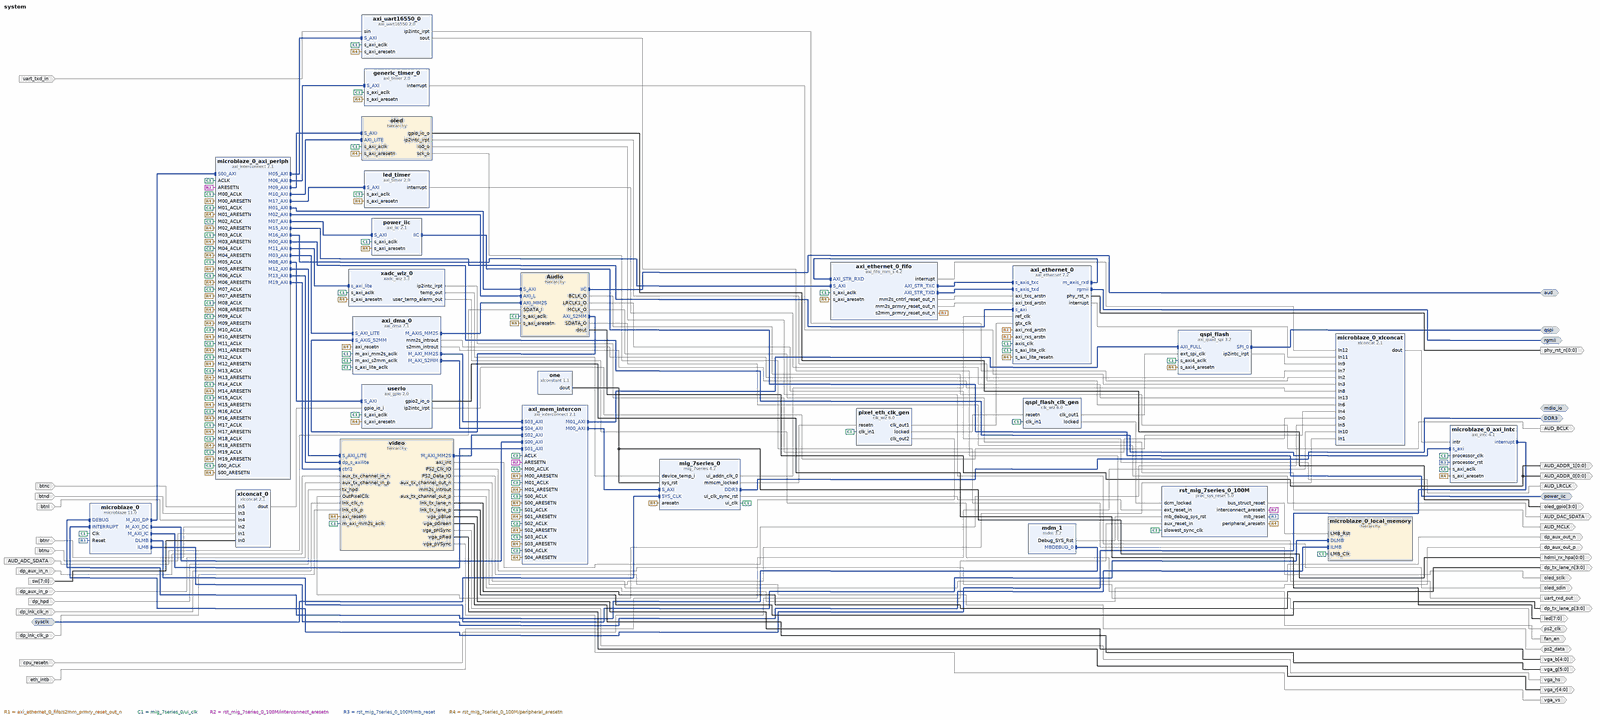
[diagram p0: block diagram of the top level, whole]
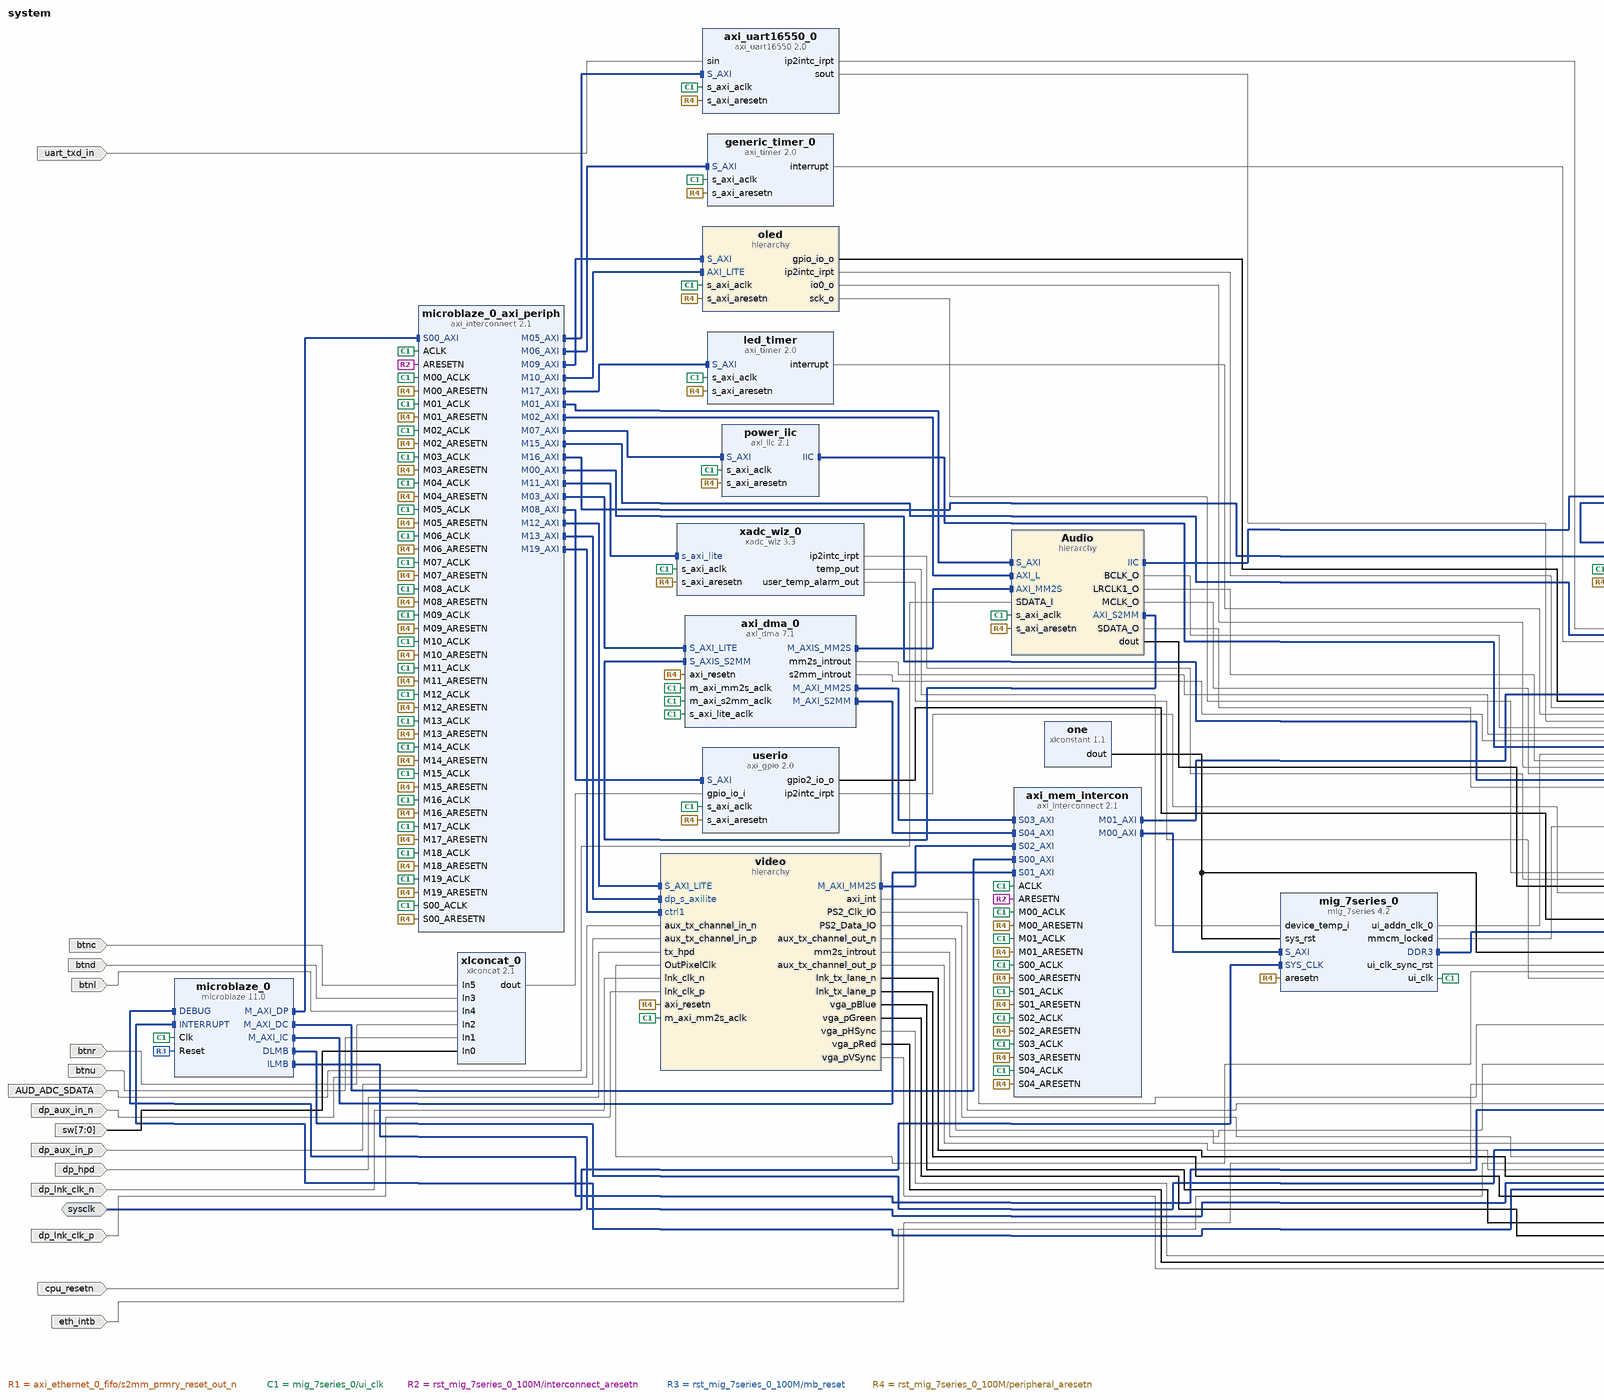
[diagram p1: block diagram of the top level, left part]
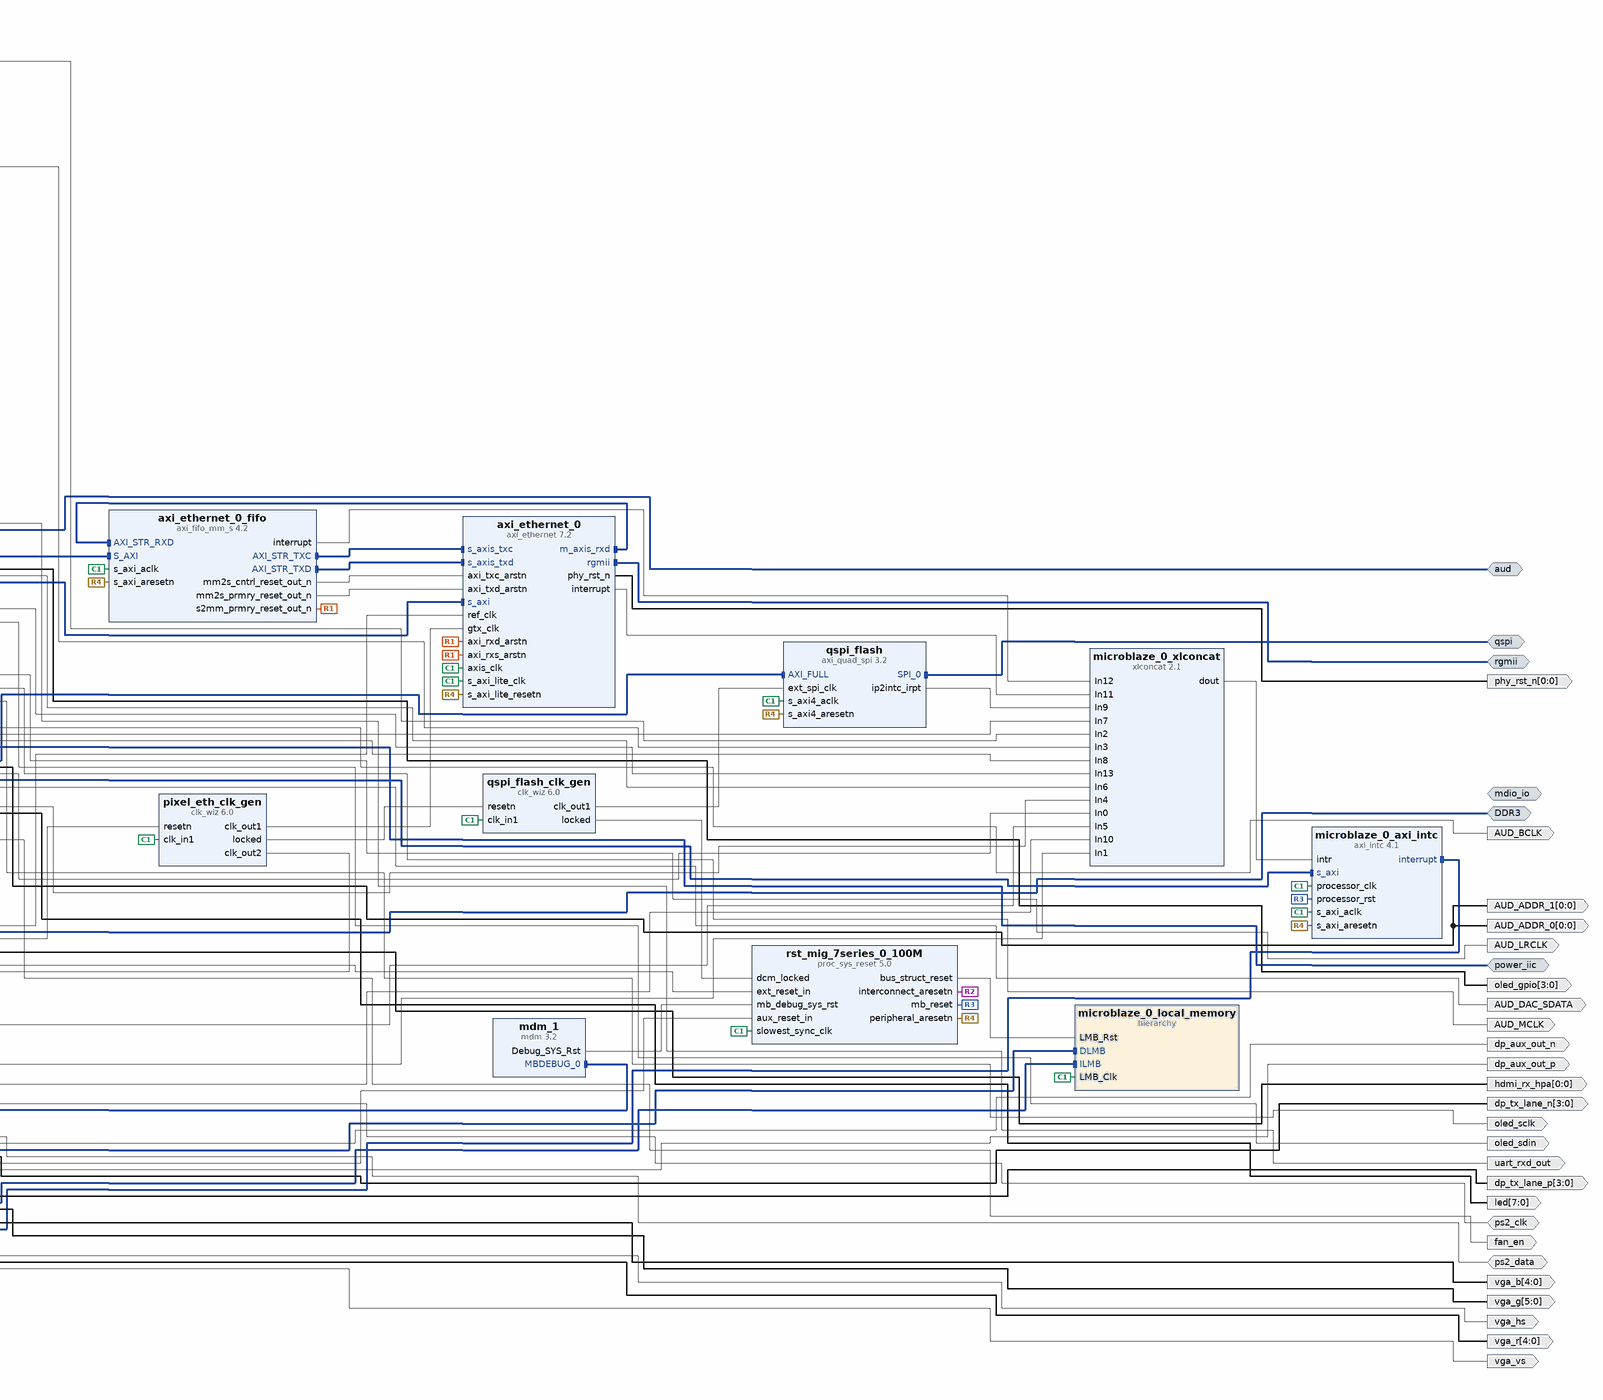
[diagram p2: block diagram of the top level, right part]
# Vivado block design system, xc7k325tffg900-2, Vivado 2022.2
create_bd_design system

create_bd_intf_port -mode Master -vlnv xilinx.com:interface:ddrx_rtl:1.0 DDR3
create_bd_intf_port -mode Master -vlnv xilinx.com:interface:iic_rtl:1.0 aud
create_bd_intf_port -mode Master -vlnv xilinx.com:interface:mdio_io:1.0 mdio_io
create_bd_intf_port -mode Master -vlnv xilinx.com:interface:iic_rtl:1.0 power_iic
create_bd_intf_port -mode Master -vlnv xilinx.com:interface:spi_rtl:1.0 qspi
create_bd_intf_port -mode Master -vlnv xilinx.com:interface:rgmii_rtl:1.0 rgmii
create_bd_intf_port -mode Slave -vlnv xilinx.com:interface:diff_clock_rtl:1.0 sysclk
create_bd_port -dir I AUD_ADC_SDATA
create_bd_port -dir IO ps2_clk
create_bd_port -dir IO ps2_data
create_bd_port -dir O -from 0 -to 0 -type rst phy_rst_n
create_bd_port -dir O -from 3 -to 0 oled_gpio
create_bd_port -dir O oled_sdin
create_bd_port -dir O oled_sclk
create_bd_port -dir O uart_rxd_out
create_bd_port -dir I btnc
create_bd_port -dir I btnd
create_bd_port -dir I btnl
create_bd_port -dir I btnr
create_bd_port -dir I btnu
create_bd_port -dir I -type rst cpu_resetn
create_bd_port -dir O AUD_BCLK
create_bd_port -dir O AUD_LRCLK
create_bd_port -dir O AUD_MCLK
create_bd_port -dir O AUD_DAC_SDATA
create_bd_port -dir I dp_aux_in_n
create_bd_port -dir I dp_aux_in_p
create_bd_port -dir I dp_hpd
create_bd_port -dir I dp_lnk_clk_n
create_bd_port -dir I dp_lnk_clk_p
create_bd_port -dir I -type intr eth_intb
set_property -dict {CONFIG.SENSITIVITY LEVEL_LOW} [get_bd_ports eth_intb]
create_bd_port -dir O -from 0 -to 0 hdmi_rx_hpa
create_bd_port -dir I uart_txd_in
create_bd_port -dir I -from 7 -to 0 sw
create_bd_port -dir O -from 7 -to 0 led
create_bd_port -dir O dp_aux_out_n
create_bd_port -dir O dp_aux_out_p
create_bd_port -dir O -from 3 -to 0 dp_tx_lane_n
create_bd_port -dir O -from 3 -to 0 dp_tx_lane_p
create_bd_port -dir O -from 4 -to 0 vga_b
create_bd_port -dir O -from 5 -to 0 vga_g
create_bd_port -dir O vga_hs
create_bd_port -dir O -from 4 -to 0 vga_r
create_bd_port -dir O vga_vs
create_bd_port -dir O fan_en
create_bd_port -dir O -from 0 -to 0 AUD_ADDR_1
create_bd_port -dir O -from 0 -to 0 AUD_ADDR_0

create_bd_cell -type hier Audio
create_bd_cell -type hier microblaze_0_local_memory
create_bd_cell -type hier oled
create_bd_cell -type hier video
create_bd_cell -type ip -vlnv xilinx.com:ip:axi_dma:7.1 axi_dma_0
set_property -dict [list \
  CONFIG.c_include_sg 0 \
  CONFIG.c_mm2s_burst_size 16 \
  CONFIG.c_s2mm_burst_size 16 \
  CONFIG.c_sg_length_width 23 \
] [get_bd_cells axi_dma_0]
create_bd_cell -type ip -vlnv xilinx.com:ip:axi_ethernet:7.2 axi_ethernet_0
set_property -dict [list \
  CONFIG.PHY_TYPE RGMII \
  CONFIG.USE_BOARD_FLOW false \
  CONFIG.rxnibblebitslice0used true \
] [get_bd_cells axi_ethernet_0]
create_bd_cell -type ip -vlnv xilinx.com:ip:axi_fifo_mm_s:4.2 axi_ethernet_0_fifo
set_property -dict [list \
  CONFIG.C_HAS_AXIS_TKEEP true \
  CONFIG.C_RX_FIFO_DEPTH 4096 \
  CONFIG.C_RX_FIFO_PE_THRESHOLD 10 \
  CONFIG.C_RX_FIFO_PF_THRESHOLD 4000 \
  CONFIG.C_TX_FIFO_DEPTH 4096 \
  CONFIG.C_TX_FIFO_PE_THRESHOLD 10 \
  CONFIG.C_TX_FIFO_PF_THRESHOLD 4000 \
] [get_bd_cells axi_ethernet_0_fifo]
create_bd_cell -type ip -vlnv xilinx.com:ip:axi_interconnect:2.1 axi_mem_intercon
set_property -dict {CONFIG.NUM_MI 2 CONFIG.NUM_SI 5 CONFIG.SYNCHRONIZATION_STAGES 2} [get_bd_cells axi_mem_intercon]
create_bd_cell -type ip -vlnv xilinx.com:ip:axi_uart16550:2.0 axi_uart16550_0
create_bd_cell -type ip -vlnv xilinx.com:ip:axi_timer:2.0 generic_timer_0
set_property -dict {CONFIG.enable_timer2 1} [get_bd_cells generic_timer_0]
create_bd_cell -type ip -vlnv xilinx.com:ip:axi_timer:2.0 led_timer
create_bd_cell -type ip -vlnv xilinx.com:ip:mdm:3.2 mdm_1
create_bd_cell -type ip -vlnv xilinx.com:ip:microblaze:11.0 microblaze_0
set_property -dict [list \
  CONFIG.C_CACHE_BYTE_SIZE 8192 \
  CONFIG.C_DCACHE_BYTE_SIZE 8192 \
  CONFIG.C_DEBUG_ENABLED 1 \
  CONFIG.C_D_AXI 1 \
  CONFIG.C_D_LMB 1 \
  CONFIG.C_ILL_OPCODE_EXCEPTION 0 \
  CONFIG.C_I_LMB 1 \
  CONFIG.C_UNALIGNED_EXCEPTIONS 0 \
  CONFIG.C_USE_BARREL 1 \
  CONFIG.C_USE_BRANCH_TARGET_CACHE 1 \
  CONFIG.C_USE_DCACHE 1 \
  CONFIG.C_USE_DIV 1 \
  CONFIG.C_USE_HW_MUL 2 \
  CONFIG.C_USE_ICACHE 1 \
  CONFIG.C_USE_PCMP_INSTR 1 \
  CONFIG.G_USE_EXCEPTIONS 0 \
] [get_bd_cells microblaze_0]
create_bd_cell -type ip -vlnv xilinx.com:ip:axi_intc:4.1 microblaze_0_axi_intc
set_property -dict {CONFIG.C_HAS_FAST 1} [get_bd_cells microblaze_0_axi_intc]
create_bd_cell -type ip -vlnv xilinx.com:ip:axi_interconnect:2.1 microblaze_0_axi_periph
set_property -dict {CONFIG.NUM_MI 20 CONFIG.SYNCHRONIZATION_STAGES 2} [get_bd_cells microblaze_0_axi_periph]
create_bd_cell -type ip -vlnv xilinx.com:ip:xlconcat:2.1 microblaze_0_xlconcat
set_property -dict {CONFIG.NUM_PORTS 14 CONFIG.dout_width 14} [get_bd_cells microblaze_0_xlconcat]
create_bd_cell -type ip -vlnv xilinx.com:ip:mig_7series:4.2 mig_7series_0
set_property -dict [list \
  CONFIG.BOARD_MIG_PARAM Custom \
  CONFIG.MIG_DONT_TOUCH_PARAM Custom \
  CONFIG.RESET_BOARD_INTERFACE Custom \
  CONFIG.XML_INPUT_FILE mig_b.prj \
] [get_bd_cells mig_7series_0]
create_bd_cell -type ip -vlnv xilinx.com:ip:xlconstant:1.1 one
create_bd_cell -type ip -vlnv xilinx.com:ip:clk_wiz:6.0 pixel_eth_clk_gen
set_property -dict [list \
  CONFIG.CLKOUT1_JITTER 229.006 \
  CONFIG.CLKOUT1_PHASE_ERROR 248.735 \
  CONFIG.CLKOUT1_REQUESTED_OUT_FREQ 125 \
  CONFIG.CLKOUT1_USED true \
  CONFIG.CLKOUT2_JITTER 222.598 \
  CONFIG.CLKOUT2_PHASE_ERROR 248.735 \
  CONFIG.CLKOUT2_REQUESTED_OUT_FREQ 148.5 \
  CONFIG.CLKOUT2_USED true \
  CONFIG.CLKOUT3_JITTER 253.529 \
  CONFIG.CLKOUT3_PHASE_ERROR 248.735 \
  CONFIG.CLKOUT3_REQUESTED_OUT_FREQ 100.000 \
  CONFIG.CLKOUT3_USED false \
  CONFIG.MMCM_CLKFBOUT_MULT_F 35.625 \
  CONFIG.MMCM_CLKIN1_PERIOD 10.000 \
  CONFIG.MMCM_CLKIN2_PERIOD 10.000 \
  CONFIG.MMCM_CLKOUT0_DIVIDE_F 7.125 \
  CONFIG.MMCM_CLKOUT1_DIVIDE 6 \
  CONFIG.MMCM_CLKOUT2_DIVIDE 1 \
  CONFIG.MMCM_DIVCLK_DIVIDE 4 \
  CONFIG.NUM_OUT_CLKS 2 \
  CONFIG.PRIM_SOURCE No_buffer \
  CONFIG.RESET_PORT resetn \
  CONFIG.RESET_TYPE ACTIVE_LOW \
] [get_bd_cells pixel_eth_clk_gen]
create_bd_cell -type ip -vlnv xilinx.com:ip:axi_iic:2.1 power_iic
set_property -dict {CONFIG.C_SCL_INERTIAL_DELAY 5 CONFIG.C_SDA_INERTIAL_DELAY 5 CONFIG.IIC_FREQ_KHZ 400} [get_bd_cells power_iic]
create_bd_cell -type ip -vlnv xilinx.com:ip:axi_quad_spi:3.2 qspi_flash
set_property -dict [list \
  CONFIG.C_FIFO_DEPTH 256 \
  CONFIG.C_SPI_MEMORY 3 \
  CONFIG.C_SPI_MODE 2 \
  CONFIG.C_TYPE_OF_AXI4_INTERFACE 1 \
  CONFIG.C_USE_STARTUP 1 \
  CONFIG.C_XIP_MODE 0 \
] [get_bd_cells qspi_flash]
create_bd_cell -type ip -vlnv xilinx.com:ip:clk_wiz:6.0 qspi_flash_clk_gen
set_property -dict [list \
  CONFIG.CLKOUT1_JITTER 127.220 \
  CONFIG.CLKOUT1_PHASE_ERROR 105.461 \
  CONFIG.CLKOUT1_REQUESTED_OUT_FREQ 150 \
  CONFIG.MMCM_CLKFBOUT_MULT_F 9 \
  CONFIG.MMCM_CLKIN1_PERIOD 10.000 \
  CONFIG.MMCM_CLKIN2_PERIOD 10.000 \
  CONFIG.MMCM_CLKOUT0_DIVIDE_F 6 \
  CONFIG.PRIMITIVE PLL \
  CONFIG.PRIM_SOURCE No_buffer \
  CONFIG.RESET_PORT resetn \
  CONFIG.RESET_TYPE ACTIVE_LOW \
] [get_bd_cells qspi_flash_clk_gen]
create_bd_cell -type ip -vlnv xilinx.com:ip:proc_sys_reset:5.0 rst_mig_7series_0_100M
create_bd_cell -type ip -vlnv xilinx.com:ip:axi_gpio:2.0 userio
set_property -dict [list \
  CONFIG.C_ALL_INPUTS 1 \
  CONFIG.C_ALL_OUTPUTS_2 1 \
  CONFIG.C_GPIO2_WIDTH 8 \
  CONFIG.C_GPIO_WIDTH 13 \
  CONFIG.C_INTERRUPT_PRESENT 1 \
  CONFIG.C_IS_DUAL 1 \
] [get_bd_cells userio]
create_bd_cell -type ip -vlnv xilinx.com:ip:xadc_wiz:3.3 xadc_wiz_0
set_property -dict [list \
  CONFIG.ADC_OFFSET_AND_GAIN_CALIBRATION true \
  CONFIG.ADC_OFFSET_CALIBRATION true \
  CONFIG.CHANNEL_ENABLE_TEMPERATURE true \
  CONFIG.CHANNEL_ENABLE_VBRAM true \
  CONFIG.CHANNEL_ENABLE_VCCAUX true \
  CONFIG.CHANNEL_ENABLE_VCCINT true \
  CONFIG.CHANNEL_ENABLE_VP_VN true \
  CONFIG.ENABLE_RESET false \
  CONFIG.ENABLE_TEMP_BUS true \
  CONFIG.INTERFACE_SELECTION Enable_AXI \
  CONFIG.SENSOR_OFFSET_AND_GAIN_CALIBRATION true \
  CONFIG.SENSOR_OFFSET_CALIBRATION true \
  CONFIG.SEQUENCER_MODE Continuous \
  CONFIG.TEMPERATURE_ALARM_RESET 45 \
  CONFIG.TEMPERATURE_ALARM_TRIGGER 60 \
  CONFIG.XADC_STARUP_SELECTION channel_sequencer \
] [get_bd_cells xadc_wiz_0]
create_bd_cell -type ip -vlnv xilinx.com:ip:xlconcat:2.1 xlconcat_0
set_property -dict {CONFIG.NUM_PORTS 6 CONFIG.dout_width 13} [get_bd_cells xlconcat_0]

# ---- hierarchy /Audio ----
current_bd_instance /Audio
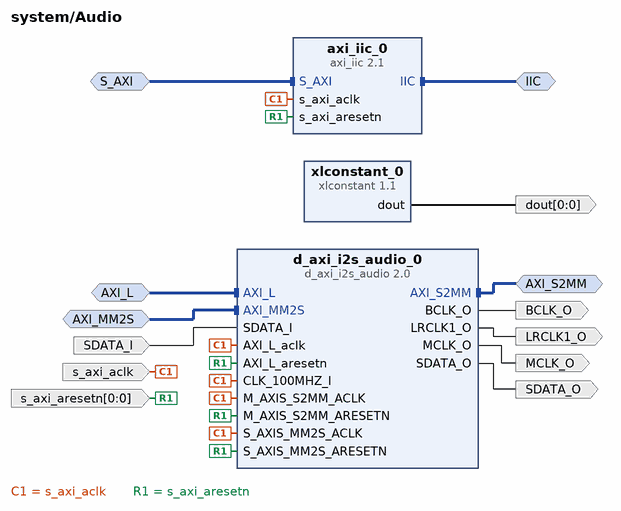
[diagram p3: block diagram inside /Audio]
create_bd_intf_pin -mode Slave -vlnv xilinx.com:interface:aximm_rtl:1.0 AXI_L
create_bd_intf_pin -mode Slave -vlnv xilinx.com:interface:axis_rtl:1.0 AXI_MM2S
create_bd_intf_pin -mode Master -vlnv xilinx.com:interface:axis_rtl:1.0 AXI_S2MM
create_bd_intf_pin -mode Master -vlnv xilinx.com:interface:iic_rtl:1.0 IIC
create_bd_intf_pin -mode Slave -vlnv xilinx.com:interface:aximm_rtl:1.0 S_AXI
create_bd_pin -dir O BCLK_O
create_bd_pin -dir O LRCLK1_O
create_bd_pin -dir O MCLK_O
create_bd_pin -dir I SDATA_I
create_bd_pin -dir O SDATA_O
create_bd_pin -dir O -from 0 -to 0 dout
create_bd_pin -dir I -type clk s_axi_aclk
create_bd_pin -dir I -from 0 -to 0 -type rst s_axi_aresetn

create_bd_cell -type ip -vlnv xilinx.com:ip:axi_iic:2.1 axi_iic_0
create_bd_cell -type ip -vlnv digilentinc.com:user:d_axi_i2s_audio:2.0 d_axi_i2s_audio_0
set_property -dict {CONFIG.ENABLE_STREAM true CONFIG.OUTPUT_ONLY_CLK true} [get_bd_cells d_axi_i2s_audio_0]
create_bd_cell -type ip -vlnv xilinx.com:ip:xlconstant:1.1 xlconstant_0

# ---- hierarchy /microblaze_0_local_memory ----
current_bd_instance /microblaze_0_local_memory
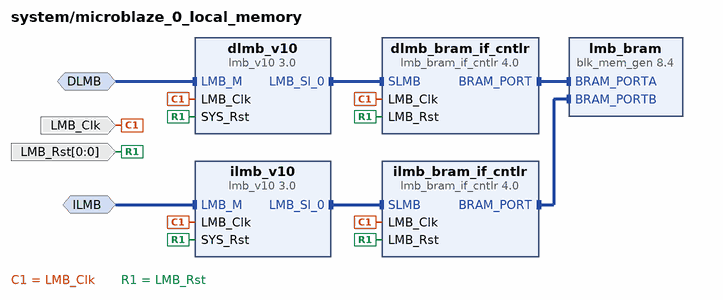
[diagram p4: block diagram inside /microblaze_0_local_memory]
create_bd_intf_pin -mode MirroredMaster -vlnv xilinx.com:interface:lmb_rtl:1.0 DLMB
create_bd_intf_pin -mode MirroredMaster -vlnv xilinx.com:interface:lmb_rtl:1.0 ILMB
create_bd_pin -dir I -type clk LMB_Clk
create_bd_pin -dir I -from 0 -to 0 -type rst LMB_Rst

create_bd_cell -type ip -vlnv xilinx.com:ip:lmb_bram_if_cntlr:4.0 dlmb_bram_if_cntlr
set_property -dict {CONFIG.C_ECC 0} [get_bd_cells dlmb_bram_if_cntlr]
create_bd_cell -type ip -vlnv xilinx.com:ip:lmb_v10:3.0 dlmb_v10
create_bd_cell -type ip -vlnv xilinx.com:ip:lmb_bram_if_cntlr:4.0 ilmb_bram_if_cntlr
set_property -dict {CONFIG.C_ECC 0} [get_bd_cells ilmb_bram_if_cntlr]
create_bd_cell -type ip -vlnv xilinx.com:ip:lmb_v10:3.0 ilmb_v10
create_bd_cell -type ip -vlnv xilinx.com:ip:blk_mem_gen:8.4 lmb_bram
set_property -dict [list \
  CONFIG.EN_SAFETY_CKT false \
  CONFIG.Enable_B Use_ENB_Pin \
  CONFIG.Memory_Type True_Dual_Port_RAM \
  CONFIG.Port_B_Clock 100 \
  CONFIG.Port_B_Enable_Rate 100 \
  CONFIG.Port_B_Write_Rate 50 \
  CONFIG.Use_RSTB_Pin true \
  CONFIG.use_bram_block BRAM_Controller \
] [get_bd_cells lmb_bram]

# ---- hierarchy /oled ----
current_bd_instance /oled
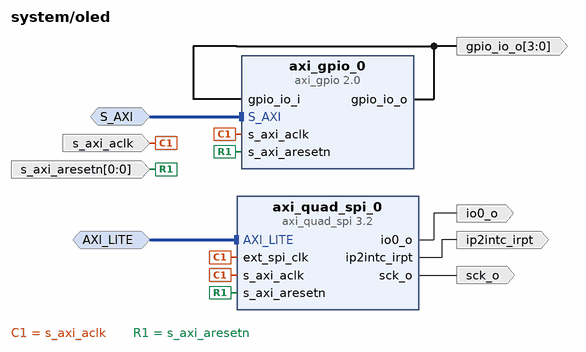
[diagram p5: block diagram inside /oled]
create_bd_intf_pin -mode Slave -vlnv xilinx.com:interface:aximm_rtl:1.0 AXI_LITE
create_bd_intf_pin -mode Slave -vlnv xilinx.com:interface:aximm_rtl:1.0 S_AXI
create_bd_pin -dir O -from 3 -to 0 gpio_io_o
create_bd_pin -dir O io0_o
create_bd_pin -dir O -type intr ip2intc_irpt
create_bd_pin -dir I -type clk s_axi_aclk
create_bd_pin -dir I -from 0 -to 0 -type rst s_axi_aresetn
create_bd_pin -dir O sck_o

create_bd_cell -type ip -vlnv xilinx.com:ip:axi_gpio:2.0 axi_gpio_0
set_property -dict {CONFIG.C_GPIO_WIDTH 4} [get_bd_cells axi_gpio_0]
create_bd_cell -type ip -vlnv xilinx.com:ip:axi_quad_spi:3.2 axi_quad_spi_0
set_property -dict {CONFIG.C_FIFO_DEPTH 256 CONFIG.C_USE_STARTUP 0 CONFIG.Multiples16 6} [get_bd_cells axi_quad_spi_0]

# ---- hierarchy /video ----
current_bd_instance /video
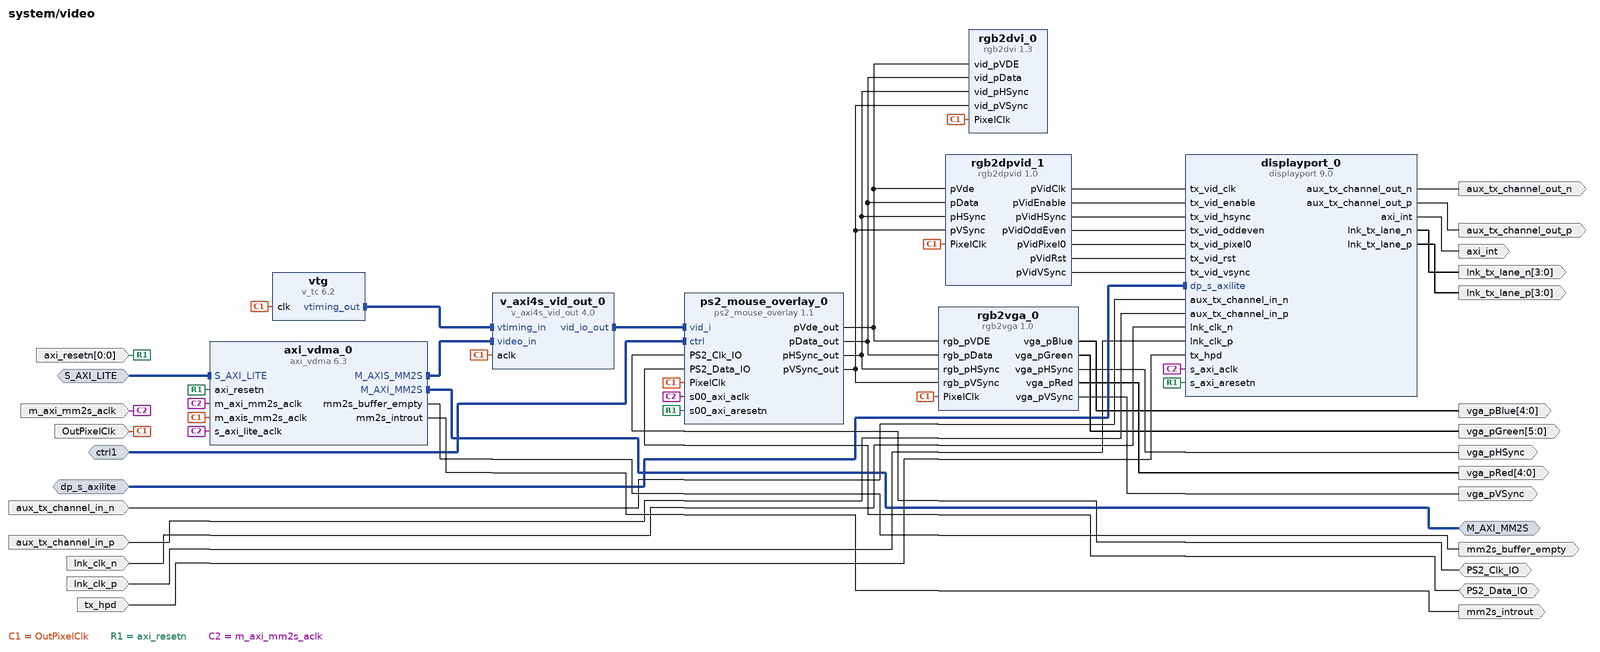
[diagram p6: block diagram inside /video]
create_bd_intf_pin -mode Master -vlnv xilinx.com:interface:aximm_rtl:1.0 M_AXI_MM2S
create_bd_intf_pin -mode Slave -vlnv xilinx.com:interface:aximm_rtl:1.0 S_AXI_LITE
create_bd_intf_pin -mode Slave -vlnv xilinx.com:interface:aximm_rtl:1.0 ctrl1
create_bd_intf_pin -mode Slave -vlnv xilinx.com:interface:aximm_rtl:1.0 dp_s_axilite
create_bd_pin -dir I -type clk OutPixelClk
create_bd_pin -dir IO PS2_Clk_IO
create_bd_pin -dir IO PS2_Data_IO
create_bd_pin -dir I aux_tx_channel_in_n
create_bd_pin -dir I aux_tx_channel_in_p
create_bd_pin -dir O aux_tx_channel_out_n
create_bd_pin -dir O aux_tx_channel_out_p
create_bd_pin -dir O -type intr axi_int
create_bd_pin -dir I -from 0 -to 0 -type rst axi_resetn
create_bd_pin -dir I -type clk lnk_clk_n
create_bd_pin -dir I -type clk lnk_clk_p
create_bd_pin -dir O -from 3 -to 0 lnk_tx_lane_n
create_bd_pin -dir O -from 3 -to 0 lnk_tx_lane_p
create_bd_pin -dir I -type clk m_axi_mm2s_aclk
create_bd_pin -dir O mm2s_buffer_empty
create_bd_pin -dir O -type intr mm2s_introut
create_bd_pin -dir I tx_hpd
create_bd_pin -dir O -from 4 -to 0 vga_pBlue
create_bd_pin -dir O -from 5 -to 0 vga_pGreen
create_bd_pin -dir O vga_pHSync
create_bd_pin -dir O -from 4 -to 0 vga_pRed
create_bd_pin -dir O vga_pVSync

create_bd_cell -type ip -vlnv digilentinc.com:ip:ps2_mouse_overlay:1.1 ps2_mouse_overlay_0
create_bd_cell -type ip -vlnv digilentinc.com:ip:rgb2dpvid:1.0 rgb2dpvid_1
create_bd_cell -type ip -vlnv digilentinc.com:ip:rgb2vga:1.0 rgb2vga_0
create_bd_cell -type ip -vlnv digilentinc.com:ip:rgb2dvi:1.3 rgb2dvi_0
create_bd_cell -type ip -vlnv xilinx.com:ip:axi_vdma:6.3 axi_vdma_0
set_property -dict [list \
  CONFIG.c_enable_all 1 \
  CONFIG.c_include_s2mm 0 \
  CONFIG.c_m_axi_mm2s_data_width 256 \
  CONFIG.c_m_axis_mm2s_tdata_width 24 \
  CONFIG.c_mm2s_genlock_mode 0 \
  CONFIG.c_mm2s_linebuffer_depth 4096 \
  CONFIG.c_mm2s_max_burst_length 2 \
] [get_bd_cells axi_vdma_0]
create_bd_cell -type ip -vlnv xilinx.com:ip:displayport:9.0 displayport_0
set_property -dict [list \
  CONFIG.Link_Rate 5.4 \
  CONFIG.Max_Bits_Per_Color 8 \
  CONFIG.Protocol_Selection DP_1_2 \
] [get_bd_cells displayport_0]
create_bd_cell -type ip -vlnv xilinx.com:ip:v_axi4s_vid_out:4.0 v_axi4s_vid_out_0
set_property -dict {CONFIG.C_VTG_MASTER_SLAVE 1} [get_bd_cells v_axi4s_vid_out_0]
create_bd_cell -type ip -vlnv xilinx.com:ip:v_tc:6.2 vtg
set_property -dict [list \
  CONFIG.HAS_AXI4_LITE false \
  CONFIG.VIDEO_MODE 1080p \
  CONFIG.enable_detection false \
  CONFIG.horizontal_blank_generation true \
  CONFIG.vertical_blank_generation true \
] [get_bd_cells vtg]

# ---- connections ----

current_bd_instance /Audio
connect_bd_intf_net [get_bd_intf_pins S_AXI] [get_bd_intf_pins axi_iic_0/S_AXI]
connect_bd_intf_net [get_bd_intf_pins AXI_L] [get_bd_intf_pins d_axi_i2s_audio_0/AXI_L]
connect_bd_intf_net [get_bd_intf_pins AXI_MM2S] [get_bd_intf_pins d_axi_i2s_audio_0/AXI_MM2S]
connect_bd_intf_net [get_bd_intf_pins AXI_S2MM] [get_bd_intf_pins d_axi_i2s_audio_0/AXI_S2MM]
connect_bd_intf_net [get_bd_intf_pins IIC] [get_bd_intf_pins axi_iic_0/IIC]
connect_bd_net [get_bd_pins SDATA_I] [get_bd_pins d_axi_i2s_audio_0/SDATA_I]
connect_bd_net [get_bd_pins d_axi_i2s_audio_0/BCLK_O] [get_bd_pins BCLK_O]
connect_bd_net [get_bd_pins d_axi_i2s_audio_0/LRCLK1_O] [get_bd_pins LRCLK1_O]
connect_bd_net [get_bd_pins d_axi_i2s_audio_0/MCLK_O] [get_bd_pins MCLK_O]
connect_bd_net [get_bd_pins d_axi_i2s_audio_0/SDATA_O] [get_bd_pins SDATA_O]
connect_bd_net [get_bd_pins s_axi_aclk] \
  [get_bd_pins axi_iic_0/s_axi_aclk] [get_bd_pins d_axi_i2s_audio_0/CLK_100MHZ_I] \
  [get_bd_pins d_axi_i2s_audio_0/S_AXIS_MM2S_ACLK] [get_bd_pins d_axi_i2s_audio_0/M_AXIS_S2MM_ACLK] \
  [get_bd_pins d_axi_i2s_audio_0/AXI_L_aclk]
connect_bd_net [get_bd_pins s_axi_aresetn] \
  [get_bd_pins axi_iic_0/s_axi_aresetn] [get_bd_pins d_axi_i2s_audio_0/S_AXIS_MM2S_ARESETN] \
  [get_bd_pins d_axi_i2s_audio_0/M_AXIS_S2MM_ARESETN] [get_bd_pins d_axi_i2s_audio_0/AXI_L_aresetn]
connect_bd_net [get_bd_pins xlconstant_0/dout] [get_bd_pins dout]

current_bd_instance /microblaze_0_local_memory
connect_bd_intf_net -intf_net microblaze_0_dlmb [get_bd_intf_pins DLMB] [get_bd_intf_pins dlmb_v10/LMB_M]
connect_bd_intf_net -intf_net microblaze_0_dlmb_bus [get_bd_intf_pins dlmb_bram_if_cntlr/SLMB] [get_bd_intf_pins dlmb_v10/LMB_Sl_0]
connect_bd_intf_net -intf_net microblaze_0_dlmb_cntlr [get_bd_intf_pins dlmb_bram_if_cntlr/BRAM_PORT] [get_bd_intf_pins lmb_bram/BRAM_PORTA]
connect_bd_intf_net -intf_net microblaze_0_ilmb [get_bd_intf_pins ILMB] [get_bd_intf_pins ilmb_v10/LMB_M]
connect_bd_intf_net -intf_net microblaze_0_ilmb_bus [get_bd_intf_pins ilmb_bram_if_cntlr/SLMB] [get_bd_intf_pins ilmb_v10/LMB_Sl_0]
connect_bd_intf_net -intf_net microblaze_0_ilmb_cntlr [get_bd_intf_pins ilmb_bram_if_cntlr/BRAM_PORT] [get_bd_intf_pins lmb_bram/BRAM_PORTB]
connect_bd_net -net microblaze_0_Clk [get_bd_pins LMB_Clk] \
  [get_bd_pins dlmb_bram_if_cntlr/LMB_Clk] [get_bd_pins dlmb_v10/LMB_Clk] [get_bd_pins ilmb_bram_if_cntlr/LMB_Clk] \
  [get_bd_pins ilmb_v10/LMB_Clk]
connect_bd_net -net microblaze_0_LMB_Rst [get_bd_pins LMB_Rst] \
  [get_bd_pins dlmb_bram_if_cntlr/LMB_Rst] [get_bd_pins dlmb_v10/SYS_Rst] [get_bd_pins ilmb_bram_if_cntlr/LMB_Rst] \
  [get_bd_pins ilmb_v10/SYS_Rst]
set_property HDL_ATTRIBUTE.BMM_INFO_ADDRESS_SPACE {byte  0x00000000 32 > system microblaze_0_local_memory/lmb_bram} [get_bd_cells dlmb_bram_if_cntlr]
set_property HDL_ATTRIBUTE.KEEP_HIERARCHY yes [get_bd_cells dlmb_bram_if_cntlr]

current_bd_instance /oled
connect_bd_intf_net [get_bd_intf_pins S_AXI] [get_bd_intf_pins axi_gpio_0/S_AXI]
connect_bd_intf_net [get_bd_intf_pins AXI_LITE] [get_bd_intf_pins axi_quad_spi_0/AXI_LITE]
connect_bd_net [get_bd_pins axi_gpio_0/gpio_io_o] [get_bd_pins gpio_io_o] [get_bd_pins axi_gpio_0/gpio_io_i]
connect_bd_net [get_bd_pins axi_quad_spi_0/io0_o] [get_bd_pins io0_o]
connect_bd_net [get_bd_pins axi_quad_spi_0/ip2intc_irpt] [get_bd_pins ip2intc_irpt]
connect_bd_net [get_bd_pins axi_quad_spi_0/sck_o] [get_bd_pins sck_o]
connect_bd_net [get_bd_pins s_axi_aclk] \
  [get_bd_pins axi_gpio_0/s_axi_aclk] [get_bd_pins axi_quad_spi_0/ext_spi_clk] [get_bd_pins axi_quad_spi_0/s_axi_aclk]
connect_bd_net [get_bd_pins s_axi_aresetn] [get_bd_pins axi_gpio_0/s_axi_aresetn] [get_bd_pins axi_quad_spi_0/s_axi_aresetn]

current_bd_instance /video
connect_bd_intf_net [get_bd_intf_pins M_AXI_MM2S] [get_bd_intf_pins axi_vdma_0/M_AXI_MM2S]
connect_bd_intf_net [get_bd_intf_pins S_AXI_LITE] [get_bd_intf_pins axi_vdma_0/S_AXI_LITE]
connect_bd_intf_net [get_bd_intf_pins dp_s_axilite] [get_bd_intf_pins displayport_0/dp_s_axilite]
connect_bd_intf_net [get_bd_intf_pins ctrl1] [get_bd_intf_pins ps2_mouse_overlay_0/ctrl]
connect_bd_intf_net [get_bd_intf_pins axi_vdma_0/M_AXIS_MM2S] [get_bd_intf_pins v_axi4s_vid_out_0/video_in]
connect_bd_intf_net [get_bd_intf_pins ps2_mouse_overlay_0/vid_i] [get_bd_intf_pins v_axi4s_vid_out_0/vid_io_out]
connect_bd_intf_net [get_bd_intf_pins v_axi4s_vid_out_0/vtiming_in] [get_bd_intf_pins vtg/vtiming_out]
connect_bd_net [get_bd_pins PS2_Clk_IO] [get_bd_pins ps2_mouse_overlay_0/PS2_Clk_IO]
connect_bd_net [get_bd_pins PS2_Data_IO] [get_bd_pins ps2_mouse_overlay_0/PS2_Data_IO]
connect_bd_net -net aclk_1 [get_bd_pins OutPixelClk] \
  [get_bd_pins ps2_mouse_overlay_0/PixelClk] [get_bd_pins rgb2dpvid_1/PixelClk] [get_bd_pins rgb2vga_0/PixelClk] \
  [get_bd_pins rgb2dvi_0/PixelClk] [get_bd_pins axi_vdma_0/m_axis_mm2s_aclk] [get_bd_pins v_axi4s_vid_out_0/aclk] \
  [get_bd_pins vtg/clk]
connect_bd_net [get_bd_pins aux_tx_channel_in_n] [get_bd_pins displayport_0/aux_tx_channel_in_n]
connect_bd_net [get_bd_pins aux_tx_channel_in_p] [get_bd_pins displayport_0/aux_tx_channel_in_p]
connect_bd_net [get_bd_pins axi_resetn] \
  [get_bd_pins ps2_mouse_overlay_0/s00_axi_aresetn] [get_bd_pins axi_vdma_0/axi_resetn] \
  [get_bd_pins displayport_0/s_axi_aresetn]
connect_bd_net [get_bd_pins axi_vdma_0/mm2s_buffer_empty] [get_bd_pins mm2s_buffer_empty]
connect_bd_net [get_bd_pins axi_vdma_0/mm2s_introut] [get_bd_pins mm2s_introut]
connect_bd_net -net displayport_1_aux_tx_channel_out_n [get_bd_pins displayport_0/aux_tx_channel_out_n] [get_bd_pins aux_tx_channel_out_n]
connect_bd_net -net displayport_1_aux_tx_channel_out_p [get_bd_pins displayport_0/aux_tx_channel_out_p] [get_bd_pins aux_tx_channel_out_p]
connect_bd_net -net displayport_1_axi_int [get_bd_pins displayport_0/axi_int] [get_bd_pins axi_int]
connect_bd_net -net displayport_1_lnk_tx_lane_n [get_bd_pins displayport_0/lnk_tx_lane_n] [get_bd_pins lnk_tx_lane_n]
connect_bd_net -net displayport_1_lnk_tx_lane_p [get_bd_pins displayport_0/lnk_tx_lane_p] [get_bd_pins lnk_tx_lane_p]
connect_bd_net [get_bd_pins lnk_clk_n] [get_bd_pins displayport_0/lnk_clk_n]
connect_bd_net [get_bd_pins lnk_clk_p] [get_bd_pins displayport_0/lnk_clk_p]
connect_bd_net [get_bd_pins m_axi_mm2s_aclk] \
  [get_bd_pins ps2_mouse_overlay_0/s00_axi_aclk] [get_bd_pins axi_vdma_0/s_axi_lite_aclk] \
  [get_bd_pins axi_vdma_0/m_axi_mm2s_aclk] [get_bd_pins displayport_0/s_axi_aclk]
connect_bd_net [get_bd_pins rgb2dpvid_1/pVidClk] [get_bd_pins displayport_0/tx_vid_clk]
connect_bd_net [get_bd_pins rgb2dpvid_1/pVidEnable] [get_bd_pins displayport_0/tx_vid_enable]
connect_bd_net [get_bd_pins rgb2dpvid_1/pVidHSync] [get_bd_pins displayport_0/tx_vid_hsync]
connect_bd_net [get_bd_pins rgb2dpvid_1/pVidOddEven] [get_bd_pins displayport_0/tx_vid_oddeven]
connect_bd_net [get_bd_pins rgb2dpvid_1/pVidPixel0] [get_bd_pins displayport_0/tx_vid_pixel0]
connect_bd_net [get_bd_pins rgb2dpvid_1/pVidRst] [get_bd_pins displayport_0/tx_vid_rst]
connect_bd_net [get_bd_pins rgb2dpvid_1/pVidVSync] [get_bd_pins displayport_0/tx_vid_vsync]
connect_bd_net [get_bd_pins rgb2vga_0/vga_pBlue] [get_bd_pins vga_pBlue]
connect_bd_net [get_bd_pins rgb2vga_0/vga_pGreen] [get_bd_pins vga_pGreen]
connect_bd_net [get_bd_pins rgb2vga_0/vga_pHSync] [get_bd_pins vga_pHSync]
connect_bd_net [get_bd_pins rgb2vga_0/vga_pRed] [get_bd_pins vga_pRed]
connect_bd_net [get_bd_pins rgb2vga_0/vga_pVSync] [get_bd_pins vga_pVSync]
connect_bd_net [get_bd_pins tx_hpd] [get_bd_pins displayport_0/tx_hpd]
connect_bd_net -net v_axi4s_vid_out_0_vid_active_video [get_bd_pins ps2_mouse_overlay_0/pVde_out] \
  [get_bd_pins rgb2dpvid_1/pVde] [get_bd_pins rgb2vga_0/rgb_pVDE] [get_bd_pins rgb2dvi_0/vid_pVDE]
connect_bd_net -net v_axi4s_vid_out_0_vid_data [get_bd_pins ps2_mouse_overlay_0/pData_out] \
  [get_bd_pins rgb2dpvid_1/pData] [get_bd_pins rgb2vga_0/rgb_pData] [get_bd_pins rgb2dvi_0/vid_pData]
connect_bd_net -net v_axi4s_vid_out_0_vid_hsync [get_bd_pins ps2_mouse_overlay_0/pHSync_out] \
  [get_bd_pins rgb2dpvid_1/pHSync] [get_bd_pins rgb2vga_0/rgb_pHSync] [get_bd_pins rgb2dvi_0/vid_pHSync]
connect_bd_net -net v_axi4s_vid_out_0_vid_vsync [get_bd_pins ps2_mouse_overlay_0/pVSync_out] \
  [get_bd_pins rgb2dpvid_1/pVSync] [get_bd_pins rgb2vga_0/rgb_pVSync] [get_bd_pins rgb2dvi_0/vid_pVSync]

current_bd_instance /
connect_bd_intf_net [get_bd_intf_pins Audio/AXI_S2MM] [get_bd_intf_pins axi_dma_0/S_AXIS_S2MM]
connect_bd_intf_net [get_bd_intf_pins axi_mem_intercon/S02_AXI] [get_bd_intf_pins video/M_AXI_MM2S]
connect_bd_intf_net [get_bd_intf_pins Audio/AXI_MM2S] [get_bd_intf_pins axi_dma_0/M_AXIS_MM2S]
connect_bd_intf_net [get_bd_intf_pins axi_dma_0/M_AXI_MM2S] [get_bd_intf_pins axi_mem_intercon/S03_AXI]
connect_bd_intf_net [get_bd_intf_pins axi_dma_0/M_AXI_S2MM] [get_bd_intf_pins axi_mem_intercon/S04_AXI]
connect_bd_intf_net [get_bd_intf_pins axi_ethernet_0/s_axis_txc] [get_bd_intf_pins axi_ethernet_0_fifo/AXI_STR_TXC]
connect_bd_intf_net [get_bd_intf_pins axi_ethernet_0/s_axis_txd] [get_bd_intf_pins axi_ethernet_0_fifo/AXI_STR_TXD]
connect_bd_intf_net [get_bd_intf_pins axi_ethernet_0/m_axis_rxd] [get_bd_intf_pins axi_ethernet_0_fifo/AXI_STR_RXD]
connect_bd_intf_net [get_bd_intf_ports rgmii] [get_bd_intf_pins axi_ethernet_0/rgmii]
connect_bd_intf_net -intf_net axi_iic_0_IIC [get_bd_intf_ports aud] [get_bd_intf_pins Audio/IIC]
connect_bd_intf_net [get_bd_intf_pins axi_mem_intercon/M00_AXI] [get_bd_intf_pins mig_7series_0/S_AXI]
connect_bd_intf_net [get_bd_intf_pins axi_mem_intercon/M01_AXI] [get_bd_intf_pins qspi_flash/AXI_FULL]
connect_bd_intf_net [get_bd_intf_pins axi_mem_intercon/S00_AXI] [get_bd_intf_pins microblaze_0/M_AXI_DC]
connect_bd_intf_net [get_bd_intf_pins axi_mem_intercon/S01_AXI] [get_bd_intf_pins microblaze_0/M_AXI_IC]
connect_bd_intf_net -intf_net microblaze_0_axi_dp [get_bd_intf_pins microblaze_0/M_AXI_DP] [get_bd_intf_pins microblaze_0_axi_periph/S00_AXI]
connect_bd_intf_net [get_bd_intf_pins Audio/S_AXI] [get_bd_intf_pins microblaze_0_axi_periph/M01_AXI]
connect_bd_intf_net [get_bd_intf_pins Audio/AXI_L] [get_bd_intf_pins microblaze_0_axi_periph/M02_AXI]
connect_bd_intf_net [get_bd_intf_pins axi_dma_0/S_AXI_LITE] [get_bd_intf_pins microblaze_0_axi_periph/M03_AXI]
connect_bd_intf_net [get_bd_intf_pins axi_uart16550_0/S_AXI] [get_bd_intf_pins microblaze_0_axi_periph/M05_AXI]
connect_bd_intf_net [get_bd_intf_pins generic_timer_0/S_AXI] [get_bd_intf_pins microblaze_0_axi_periph/M06_AXI]
connect_bd_intf_net [get_bd_intf_pins microblaze_0_axi_periph/M07_AXI] [get_bd_intf_pins power_iic/S_AXI]
connect_bd_intf_net [get_bd_intf_pins microblaze_0_axi_periph/M08_AXI] [get_bd_intf_pins userio/S_AXI]
connect_bd_intf_net [get_bd_intf_pins microblaze_0_axi_periph/M09_AXI] [get_bd_intf_pins oled/S_AXI]
connect_bd_intf_net [get_bd_intf_pins microblaze_0_axi_periph/M10_AXI] [get_bd_intf_pins oled/AXI_LITE]
connect_bd_intf_net [get_bd_intf_pins microblaze_0_axi_periph/M11_AXI] [get_bd_intf_pins xadc_wiz_0/s_axi_lite]
connect_bd_intf_net [get_bd_intf_pins microblaze_0_axi_periph/M12_AXI] [get_bd_intf_pins video/S_AXI_LITE]
connect_bd_intf_net [get_bd_intf_pins microblaze_0_axi_periph/M13_AXI] [get_bd_intf_pins video/dp_s_axilite]
connect_bd_intf_net [get_bd_intf_pins axi_ethernet_0/s_axi] [get_bd_intf_pins microblaze_0_axi_periph/M15_AXI]
connect_bd_intf_net [get_bd_intf_pins axi_ethernet_0_fifo/S_AXI] [get_bd_intf_pins microblaze_0_axi_periph/M16_AXI]
connect_bd_intf_net [get_bd_intf_pins led_timer/S_AXI] [get_bd_intf_pins microblaze_0_axi_periph/M17_AXI]
connect_bd_intf_net [get_bd_intf_pins microblaze_0_axi_periph/M19_AXI] [get_bd_intf_pins video/ctrl1]
connect_bd_intf_net [get_bd_intf_pins mdm_1/MBDEBUG_0] [get_bd_intf_pins microblaze_0/DEBUG]
connect_bd_intf_net [get_bd_intf_pins microblaze_0/DLMB] [get_bd_intf_pins microblaze_0_local_memory/DLMB]
connect_bd_intf_net [get_bd_intf_pins microblaze_0/ILMB] [get_bd_intf_pins microblaze_0_local_memory/ILMB]
connect_bd_intf_net -intf_net microblaze_0_intc_axi [get_bd_intf_pins microblaze_0_axi_intc/s_axi] [get_bd_intf_pins microblaze_0_axi_periph/M00_AXI]
connect_bd_intf_net [get_bd_intf_pins microblaze_0/INTERRUPT] [get_bd_intf_pins microblaze_0_axi_intc/interrupt]
connect_bd_intf_net [get_bd_intf_ports DDR3] [get_bd_intf_pins mig_7series_0/DDR3]
connect_bd_intf_net [get_bd_intf_ports power_iic] [get_bd_intf_pins power_iic/IIC]
connect_bd_intf_net [get_bd_intf_ports qspi] [get_bd_intf_pins qspi_flash/SPI_0]
connect_bd_intf_net [get_bd_intf_ports sysclk] [get_bd_intf_pins mig_7series_0/SYS_CLK]
connect_bd_net [get_bd_ports AUD_ADC_SDATA] [get_bd_pins Audio/SDATA_I]
connect_bd_net [get_bd_ports ps2_clk] [get_bd_pins video/PS2_Clk_IO]
connect_bd_net [get_bd_ports ps2_data] [get_bd_pins video/PS2_Data_IO]
connect_bd_net [get_bd_pins axi_dma_0/mm2s_introut] [get_bd_pins microblaze_0_xlconcat/In7]
connect_bd_net [get_bd_pins axi_dma_0/s2mm_introut] [get_bd_pins microblaze_0_xlconcat/In8]
connect_bd_net [get_bd_pins axi_ethernet_0_fifo/interrupt] [get_bd_pins microblaze_0_xlconcat/In12]
connect_bd_net [get_bd_pins axi_ethernet_0_fifo/mm2s_cntrl_reset_out_n] [get_bd_pins axi_ethernet_0/axi_txc_arstn]
connect_bd_net [get_bd_pins axi_ethernet_0_fifo/mm2s_prmry_reset_out_n] [get_bd_pins axi_ethernet_0/axi_txd_arstn]
connect_bd_net [get_bd_pins axi_ethernet_0_fifo/s2mm_prmry_reset_out_n] \
  [get_bd_pins axi_ethernet_0/axi_rxd_arstn] [get_bd_pins axi_ethernet_0/axi_rxs_arstn]
connect_bd_net [get_bd_pins axi_ethernet_0/interrupt] [get_bd_pins microblaze_0_xlconcat/In11]
connect_bd_net [get_bd_pins axi_ethernet_0/phy_rst_n] [get_bd_ports phy_rst_n]
connect_bd_net -net axi_gpio_0_gpio_io_o [get_bd_pins oled/gpio_io_o] [get_bd_ports oled_gpio]
connect_bd_net -net axi_quad_spi_0_io0_o [get_bd_pins oled/io0_o] [get_bd_ports oled_sdin]
connect_bd_net -net axi_quad_spi_0_sck_o [get_bd_pins oled/sck_o] [get_bd_ports oled_sclk]
connect_bd_net [get_bd_pins axi_uart16550_0/ip2intc_irpt] [get_bd_pins microblaze_0_xlconcat/In2]
connect_bd_net [get_bd_pins axi_uart16550_0/sout] [get_bd_ports uart_rxd_out]
connect_bd_net [get_bd_ports btnc] [get_bd_pins xlconcat_0/In5]
connect_bd_net [get_bd_ports btnd] [get_bd_pins xlconcat_0/In3]
connect_bd_net [get_bd_ports btnl] [get_bd_pins xlconcat_0/In4]
connect_bd_net [get_bd_ports btnr] [get_bd_pins xlconcat_0/In2]
connect_bd_net [get_bd_ports btnu] [get_bd_pins xlconcat_0/In1]
connect_bd_net [get_bd_ports cpu_resetn] [get_bd_pins rst_mig_7series_0_100M/aux_reset_in]
connect_bd_net -net d_axi_i2s_audio_0_BCLK_O [get_bd_pins Audio/BCLK_O] [get_bd_ports AUD_BCLK]
connect_bd_net -net d_axi_i2s_audio_0_LRCLK1_O [get_bd_pins Audio/LRCLK1_O] [get_bd_ports AUD_LRCLK]
connect_bd_net -net d_axi_i2s_audio_0_MCLK_O [get_bd_pins Audio/MCLK_O] [get_bd_ports AUD_MCLK]
connect_bd_net -net d_axi_i2s_audio_0_SDATA_O [get_bd_pins Audio/SDATA_O] [get_bd_ports AUD_DAC_SDATA]
connect_bd_net [get_bd_ports dp_aux_in_n] [get_bd_pins video/aux_tx_channel_in_n]
connect_bd_net [get_bd_ports dp_aux_in_p] [get_bd_pins video/aux_tx_channel_in_p]
connect_bd_net [get_bd_ports dp_hpd] [get_bd_pins video/tx_hpd]
connect_bd_net [get_bd_ports dp_lnk_clk_n] [get_bd_pins video/lnk_clk_n]
connect_bd_net [get_bd_ports dp_lnk_clk_p] [get_bd_pins video/lnk_clk_p]
connect_bd_net [get_bd_ports eth_intb] [get_bd_pins microblaze_0_xlconcat/In10]
connect_bd_net [get_bd_pins generic_timer_0/interrupt] [get_bd_pins microblaze_0_xlconcat/In3]
connect_bd_net [get_bd_pins led_timer/interrupt] [get_bd_pins microblaze_0_xlconcat/In13]
connect_bd_net [get_bd_pins mdm_1/Debug_SYS_Rst] [get_bd_pins rst_mig_7series_0_100M/mb_debug_sys_rst]
connect_bd_net -net microblaze_0_Clk [get_bd_pins mig_7series_0/ui_clk] \
  [get_bd_pins Audio/s_axi_aclk] [get_bd_pins microblaze_0_local_memory/LMB_Clk] [get_bd_pins oled/s_axi_aclk] \
  [get_bd_pins video/m_axi_mm2s_aclk] [get_bd_pins axi_dma_0/s_axi_lite_aclk] [get_bd_pins axi_dma_0/m_axi_mm2s_aclk] \
  [get_bd_pins axi_dma_0/m_axi_s2mm_aclk] [get_bd_pins axi_ethernet_0/s_axi_lite_clk] [get_bd_pins axi_ethernet_0/axis_clk] \
  [get_bd_pins axi_ethernet_0_fifo/s_axi_aclk] [get_bd_pins axi_mem_intercon/ACLK] [get_bd_pins axi_mem_intercon/S00_ACLK] \
  [get_bd_pins axi_mem_intercon/S01_ACLK] [get_bd_pins axi_mem_intercon/S02_ACLK] [get_bd_pins axi_mem_intercon/S03_ACLK] \
  [get_bd_pins axi_mem_intercon/S04_ACLK] [get_bd_pins axi_mem_intercon/M00_ACLK] [get_bd_pins axi_mem_intercon/M01_ACLK] \
  [get_bd_pins axi_uart16550_0/s_axi_aclk] [get_bd_pins generic_timer_0/s_axi_aclk] [get_bd_pins led_timer/s_axi_aclk] \
  [get_bd_pins microblaze_0/Clk] [get_bd_pins microblaze_0_axi_intc/s_axi_aclk] \
  [get_bd_pins microblaze_0_axi_intc/processor_clk] [get_bd_pins microblaze_0_axi_periph/ACLK] \
  [get_bd_pins microblaze_0_axi_periph/S00_ACLK] [get_bd_pins microblaze_0_axi_periph/M00_ACLK] \
  [get_bd_pins microblaze_0_axi_periph/M01_ACLK] [get_bd_pins microblaze_0_axi_periph/M02_ACLK] \
  [get_bd_pins microblaze_0_axi_periph/M03_ACLK] [get_bd_pins microblaze_0_axi_periph/M04_ACLK] \
  [get_bd_pins microblaze_0_axi_periph/M05_ACLK] [get_bd_pins microblaze_0_axi_periph/M06_ACLK] \
  [get_bd_pins microblaze_0_axi_periph/M07_ACLK] [get_bd_pins microblaze_0_axi_periph/M08_ACLK] \
  [get_bd_pins microblaze_0_axi_periph/M09_ACLK] [get_bd_pins microblaze_0_axi_periph/M10_ACLK] \
  [get_bd_pins microblaze_0_axi_periph/M11_ACLK] [get_bd_pins microblaze_0_axi_periph/M12_ACLK] \
  [get_bd_pins microblaze_0_axi_periph/M13_ACLK] [get_bd_pins microblaze_0_axi_periph/M14_ACLK] \
  [get_bd_pins microblaze_0_axi_periph/M15_ACLK] [get_bd_pins microblaze_0_axi_periph/M16_ACLK] \
  [get_bd_pins microblaze_0_axi_periph/M17_ACLK] [get_bd_pins microblaze_0_axi_periph/M18_ACLK] \
  [get_bd_pins microblaze_0_axi_periph/M19_ACLK] [get_bd_pins pixel_eth_clk_gen/clk_in1] [get_bd_pins power_iic/s_axi_aclk] \
  [get_bd_pins qspi_flash/s_axi4_aclk] [get_bd_pins qspi_flash_clk_gen/clk_in1] \
  [get_bd_pins rst_mig_7series_0_100M/slowest_sync_clk] [get_bd_pins userio/s_axi_aclk] [get_bd_pins xadc_wiz_0/s_axi_aclk]
connect_bd_net -net microblaze_0_intr [get_bd_pins microblaze_0_xlconcat/dout] [get_bd_pins microblaze_0_axi_intc/intr]
connect_bd_net [get_bd_pins mig_7series_0/mmcm_locked] [get_bd_pins pixel_eth_clk_gen/resetn]
connect_bd_net [get_bd_pins mig_7series_0/ui_addn_clk_0] [get_bd_pins axi_ethernet_0/ref_clk]
connect_bd_net [get_bd_pins mig_7series_0/ui_clk_sync_rst] [get_bd_pins rst_mig_7series_0_100M/ext_reset_in]
connect_bd_net [get_bd_pins oled/ip2intc_irpt] [get_bd_pins microblaze_0_xlconcat/In6]
connect_bd_net [get_bd_pins one/dout] [get_bd_ports hdmi_rx_hpa] [get_bd_pins mig_7series_0/sys_rst]
connect_bd_net [get_bd_pins pixel_eth_clk_gen/clk_out1] [get_bd_pins axi_ethernet_0/gtx_clk]
connect_bd_net [get_bd_pins pixel_eth_clk_gen/clk_out2] [get_bd_pins video/OutPixelClk]
connect_bd_net [get_bd_pins pixel_eth_clk_gen/locked] [get_bd_pins qspi_flash_clk_gen/resetn]
connect_bd_net [get_bd_pins qspi_flash_clk_gen/clk_out1] [get_bd_pins qspi_flash/ext_spi_clk]
connect_bd_net [get_bd_pins qspi_flash_clk_gen/locked] [get_bd_pins rst_mig_7series_0_100M/dcm_locked]
connect_bd_net [get_bd_pins qspi_flash/ip2intc_irpt] [get_bd_pins microblaze_0_xlconcat/In9]
connect_bd_net [get_bd_pins rst_mig_7series_0_100M/bus_struct_reset] [get_bd_pins microblaze_0_local_memory/LMB_Rst]
connect_bd_net [get_bd_pins rst_mig_7series_0_100M/interconnect_aresetn] \
  [get_bd_pins axi_mem_intercon/ARESETN] [get_bd_pins microblaze_0_axi_periph/ARESETN]
connect_bd_net [get_bd_pins rst_mig_7series_0_100M/mb_reset] [get_bd_pins microblaze_0/Reset] [get_bd_pins microblaze_0_axi_intc/processor_rst]
connect_bd_net [get_bd_pins rst_mig_7series_0_100M/peripheral_aresetn] \
  [get_bd_pins Audio/s_axi_aresetn] [get_bd_pins oled/s_axi_aresetn] [get_bd_pins video/axi_resetn] \
  [get_bd_pins axi_dma_0/axi_resetn] [get_bd_pins axi_ethernet_0/s_axi_lite_resetn] \
  [get_bd_pins axi_ethernet_0_fifo/s_axi_aresetn] [get_bd_pins axi_mem_intercon/S00_ARESETN] \
  [get_bd_pins axi_mem_intercon/S01_ARESETN] [get_bd_pins axi_mem_intercon/S02_ARESETN] \
  [get_bd_pins axi_mem_intercon/S03_ARESETN] [get_bd_pins axi_mem_intercon/S04_ARESETN] \
  [get_bd_pins axi_mem_intercon/M00_ARESETN] [get_bd_pins axi_mem_intercon/M01_ARESETN] \
  [get_bd_pins axi_uart16550_0/s_axi_aresetn] [get_bd_pins generic_timer_0/s_axi_aresetn] \
  [get_bd_pins led_timer/s_axi_aresetn] [get_bd_pins microblaze_0_axi_intc/s_axi_aresetn] \
  [get_bd_pins microblaze_0_axi_periph/S00_ARESETN] [get_bd_pins microblaze_0_axi_periph/M00_ARESETN] \
  [get_bd_pins microblaze_0_axi_periph/M01_ARESETN] [get_bd_pins microblaze_0_axi_periph/M02_ARESETN] \
  [get_bd_pins microblaze_0_axi_periph/M03_ARESETN] [get_bd_pins microblaze_0_axi_periph/M04_ARESETN] \
  [get_bd_pins microblaze_0_axi_periph/M05_ARESETN] [get_bd_pins microblaze_0_axi_periph/M06_ARESETN] \
  [get_bd_pins microblaze_0_axi_periph/M07_ARESETN] [get_bd_pins microblaze_0_axi_periph/M08_ARESETN] \
  [get_bd_pins microblaze_0_axi_periph/M09_ARESETN] [get_bd_pins microblaze_0_axi_periph/M10_ARESETN] \
  [get_bd_pins microblaze_0_axi_periph/M11_ARESETN] [get_bd_pins microblaze_0_axi_periph/M12_ARESETN] \
  [get_bd_pins microblaze_0_axi_periph/M13_ARESETN] [get_bd_pins microblaze_0_axi_periph/M14_ARESETN] \
  [get_bd_pins microblaze_0_axi_periph/M15_ARESETN] [get_bd_pins microblaze_0_axi_periph/M16_ARESETN] \
  [get_bd_pins microblaze_0_axi_periph/M17_ARESETN] [get_bd_pins microblaze_0_axi_periph/M18_ARESETN] \
  [get_bd_pins microblaze_0_axi_periph/M19_ARESETN] [get_bd_pins mig_7series_0/aresetn] [get_bd_pins power_iic/s_axi_aresetn] \
  [get_bd_pins qspi_flash/s_axi4_aresetn] [get_bd_pins userio/s_axi_aresetn] [get_bd_pins xadc_wiz_0/s_axi_aresetn]
connect_bd_net -net sin_1 [get_bd_ports uart_txd_in] [get_bd_pins axi_uart16550_0/sin]
connect_bd_net [get_bd_ports sw] [get_bd_pins xlconcat_0/In0]
connect_bd_net [get_bd_pins userio/gpio2_io_o] [get_bd_ports led]
connect_bd_net [get_bd_pins userio/ip2intc_irpt] [get_bd_pins microblaze_0_xlconcat/In4]
connect_bd_net [get_bd_pins video/aux_tx_channel_out_n] [get_bd_ports dp_aux_out_n]
connect_bd_net [get_bd_pins video/aux_tx_channel_out_p] [get_bd_ports dp_aux_out_p]
connect_bd_net [get_bd_pins video/axi_int] [get_bd_pins microblaze_0_xlconcat/In5]
connect_bd_net [get_bd_pins video/lnk_tx_lane_n] [get_bd_ports dp_tx_lane_n]
connect_bd_net [get_bd_pins video/lnk_tx_lane_p] [get_bd_ports dp_tx_lane_p]
connect_bd_net [get_bd_pins video/mm2s_introut] [get_bd_pins microblaze_0_xlconcat/In1]
connect_bd_net [get_bd_pins video/vga_pBlue] [get_bd_ports vga_b]
connect_bd_net [get_bd_pins video/vga_pGreen] [get_bd_ports vga_g]
connect_bd_net [get_bd_pins video/vga_pHSync] [get_bd_ports vga_hs]
connect_bd_net [get_bd_pins video/vga_pRed] [get_bd_ports vga_r]
connect_bd_net [get_bd_pins video/vga_pVSync] [get_bd_ports vga_vs]
connect_bd_net [get_bd_pins xadc_wiz_0/ip2intc_irpt] [get_bd_pins microblaze_0_xlconcat/In0]
connect_bd_net [get_bd_pins xadc_wiz_0/temp_out] [get_bd_pins mig_7series_0/device_temp_i]
connect_bd_net [get_bd_pins xadc_wiz_0/user_temp_alarm_out] [get_bd_ports fan_en]
connect_bd_net [get_bd_pins xlconcat_0/dout] [get_bd_pins userio/gpio_io_i]
connect_bd_net -net xlconstant_0_dout [get_bd_pins Audio/dout] [get_bd_ports AUD_ADDR_0] [get_bd_ports AUD_ADDR_1]
set_property HDL_ATTRIBUTE.BMM_INFO_PROCESSOR {microblaze-le > system microblaze_0_local_memory/dlmb_bram_if_cntlr} [get_bd_cells microblaze_0]
set_property HDL_ATTRIBUTE.KEEP_HIERARCHY yes [get_bd_cells microblaze_0]

# ---- address map ----
assign_bd_address -offset 0x80000000 -range 1G -target_address_space [get_bd_addr_spaces axi_dma_0/Data_MM2S] [get_bd_addr_segs mig_7series_0/memmap/memaddr]
assign_bd_address -offset 0xC4000000 -range 4K -target_address_space [get_bd_addr_spaces axi_dma_0/Data_MM2S] [get_bd_addr_segs qspi_flash/aximm/MEM0]
assign_bd_address -offset 0x80000000 -range 1G -target_address_space [get_bd_addr_spaces axi_dma_0/Data_S2MM] [get_bd_addr_segs mig_7series_0/memmap/memaddr]
assign_bd_address -offset 0xC4000000 -range 4K -target_address_space [get_bd_addr_spaces axi_dma_0/Data_S2MM] [get_bd_addr_segs qspi_flash/aximm/MEM0]
assign_bd_address -offset 0x00000000 -range 16K -target_address_space [get_bd_addr_spaces microblaze_0/Data] [get_bd_addr_segs microblaze_0_local_memory/dlmb_bram_if_cntlr/SLMB/Mem]
assign_bd_address -offset 0x40000000 -range 64K -target_address_space [get_bd_addr_spaces microblaze_0/Data] [get_bd_addr_segs userio/S_AXI/Reg]
assign_bd_address -offset 0x40010000 -range 64K -target_address_space [get_bd_addr_spaces microblaze_0/Data] [get_bd_addr_segs oled/axi_gpio_0/S_AXI/Reg]
assign_bd_address -offset 0x40400000 -range 64K -target_address_space [get_bd_addr_spaces microblaze_0/Data] [get_bd_addr_segs axi_uart16550_0/S_AXI/Reg]
assign_bd_address -offset 0x40800000 -range 64K -target_address_space [get_bd_addr_spaces microblaze_0/Data] [get_bd_addr_segs Audio/axi_iic_0/S_AXI/Reg]
assign_bd_address -offset 0x40810000 -range 64K -target_address_space [get_bd_addr_spaces microblaze_0/Data] [get_bd_addr_segs power_iic/S_AXI/Reg]
assign_bd_address -offset 0x40C00000 -range 256K -target_address_space [get_bd_addr_spaces microblaze_0/Data] [get_bd_addr_segs axi_ethernet_0/s_axi/Reg0]
assign_bd_address -offset 0x41200000 -range 64K -target_address_space [get_bd_addr_spaces microblaze_0/Data] [get_bd_addr_segs microblaze_0_axi_intc/S_AXI/Reg]
assign_bd_address -offset 0x41C00000 -range 64K -target_address_space [get_bd_addr_spaces microblaze_0/Data] [get_bd_addr_segs generic_timer_0/S_AXI/Reg]
assign_bd_address -offset 0x41C10000 -range 64K -target_address_space [get_bd_addr_spaces microblaze_0/Data] [get_bd_addr_segs led_timer/S_AXI/Reg]
assign_bd_address -offset 0x41E00000 -range 64K -target_address_space [get_bd_addr_spaces microblaze_0/Data] [get_bd_addr_segs axi_dma_0/S_AXI_LITE/Reg]
assign_bd_address -offset 0x44A10000 -range 64K -target_address_space [get_bd_addr_spaces microblaze_0/Data] [get_bd_addr_segs Audio/d_axi_i2s_audio_0/AXI_L/AXI_L_reg]
assign_bd_address -offset 0x44A20000 -range 64K -target_address_space [get_bd_addr_spaces microblaze_0/Data] [get_bd_addr_segs video/displayport_0/dp_s_axilite/Reg]
assign_bd_address -offset 0x44A30000 -range 64K -target_address_space [get_bd_addr_spaces microblaze_0/Data] [get_bd_addr_segs oled/axi_quad_spi_0/AXI_LITE/Reg]
assign_bd_address -offset 0x44A40000 -range 64K -target_address_space [get_bd_addr_spaces microblaze_0/Data] [get_bd_addr_segs xadc_wiz_0/s_axi_lite/Reg]
assign_bd_address -offset 0x44A50000 -range 64K -target_address_space [get_bd_addr_spaces microblaze_0/Data] [get_bd_addr_segs video/axi_vdma_0/S_AXI_LITE/Reg]
assign_bd_address -offset 0x44A80000 -range 64K -target_address_space [get_bd_addr_spaces microblaze_0/Data] [get_bd_addr_segs axi_ethernet_0_fifo/S_AXI/Mem0]
assign_bd_address -offset 0x44A90000 -range 64K -target_address_space [get_bd_addr_spaces microblaze_0/Data] [get_bd_addr_segs video/ps2_mouse_overlay_0/s00_axi/reg0]
assign_bd_address -offset 0x80000000 -range 1G -target_address_space [get_bd_addr_spaces microblaze_0/Data] [get_bd_addr_segs mig_7series_0/memmap/memaddr]
assign_bd_address -offset 0xC4000000 -range 4K -target_address_space [get_bd_addr_spaces microblaze_0/Data] [get_bd_addr_segs qspi_flash/aximm/MEM0]
assign_bd_address -offset 0x00000000 -range 16K -target_address_space [get_bd_addr_spaces microblaze_0/Instruction] [get_bd_addr_segs microblaze_0_local_memory/ilmb_bram_if_cntlr/SLMB/Mem]
assign_bd_address -offset 0x80000000 -range 1G -target_address_space [get_bd_addr_spaces microblaze_0/Instruction] [get_bd_addr_segs mig_7series_0/memmap/memaddr]
assign_bd_address -offset 0xC4000000 -range 4K -target_address_space [get_bd_addr_spaces microblaze_0/Instruction] [get_bd_addr_segs qspi_flash/aximm/MEM0]
assign_bd_address -offset 0x80000000 -range 1G -target_address_space [get_bd_addr_spaces video/axi_vdma_0/Data_MM2S] [get_bd_addr_segs mig_7series_0/memmap/memaddr]
assign_bd_address -offset 0xC4000000 -range 4K -target_address_space [get_bd_addr_spaces video/axi_vdma_0/Data_MM2S] [get_bd_addr_segs qspi_flash/aximm/MEM0]

validate_bd_design
save_bd_design
